# EAGLE design MotorControllerV7_ControlBoard (EAGLE 7.1.0)
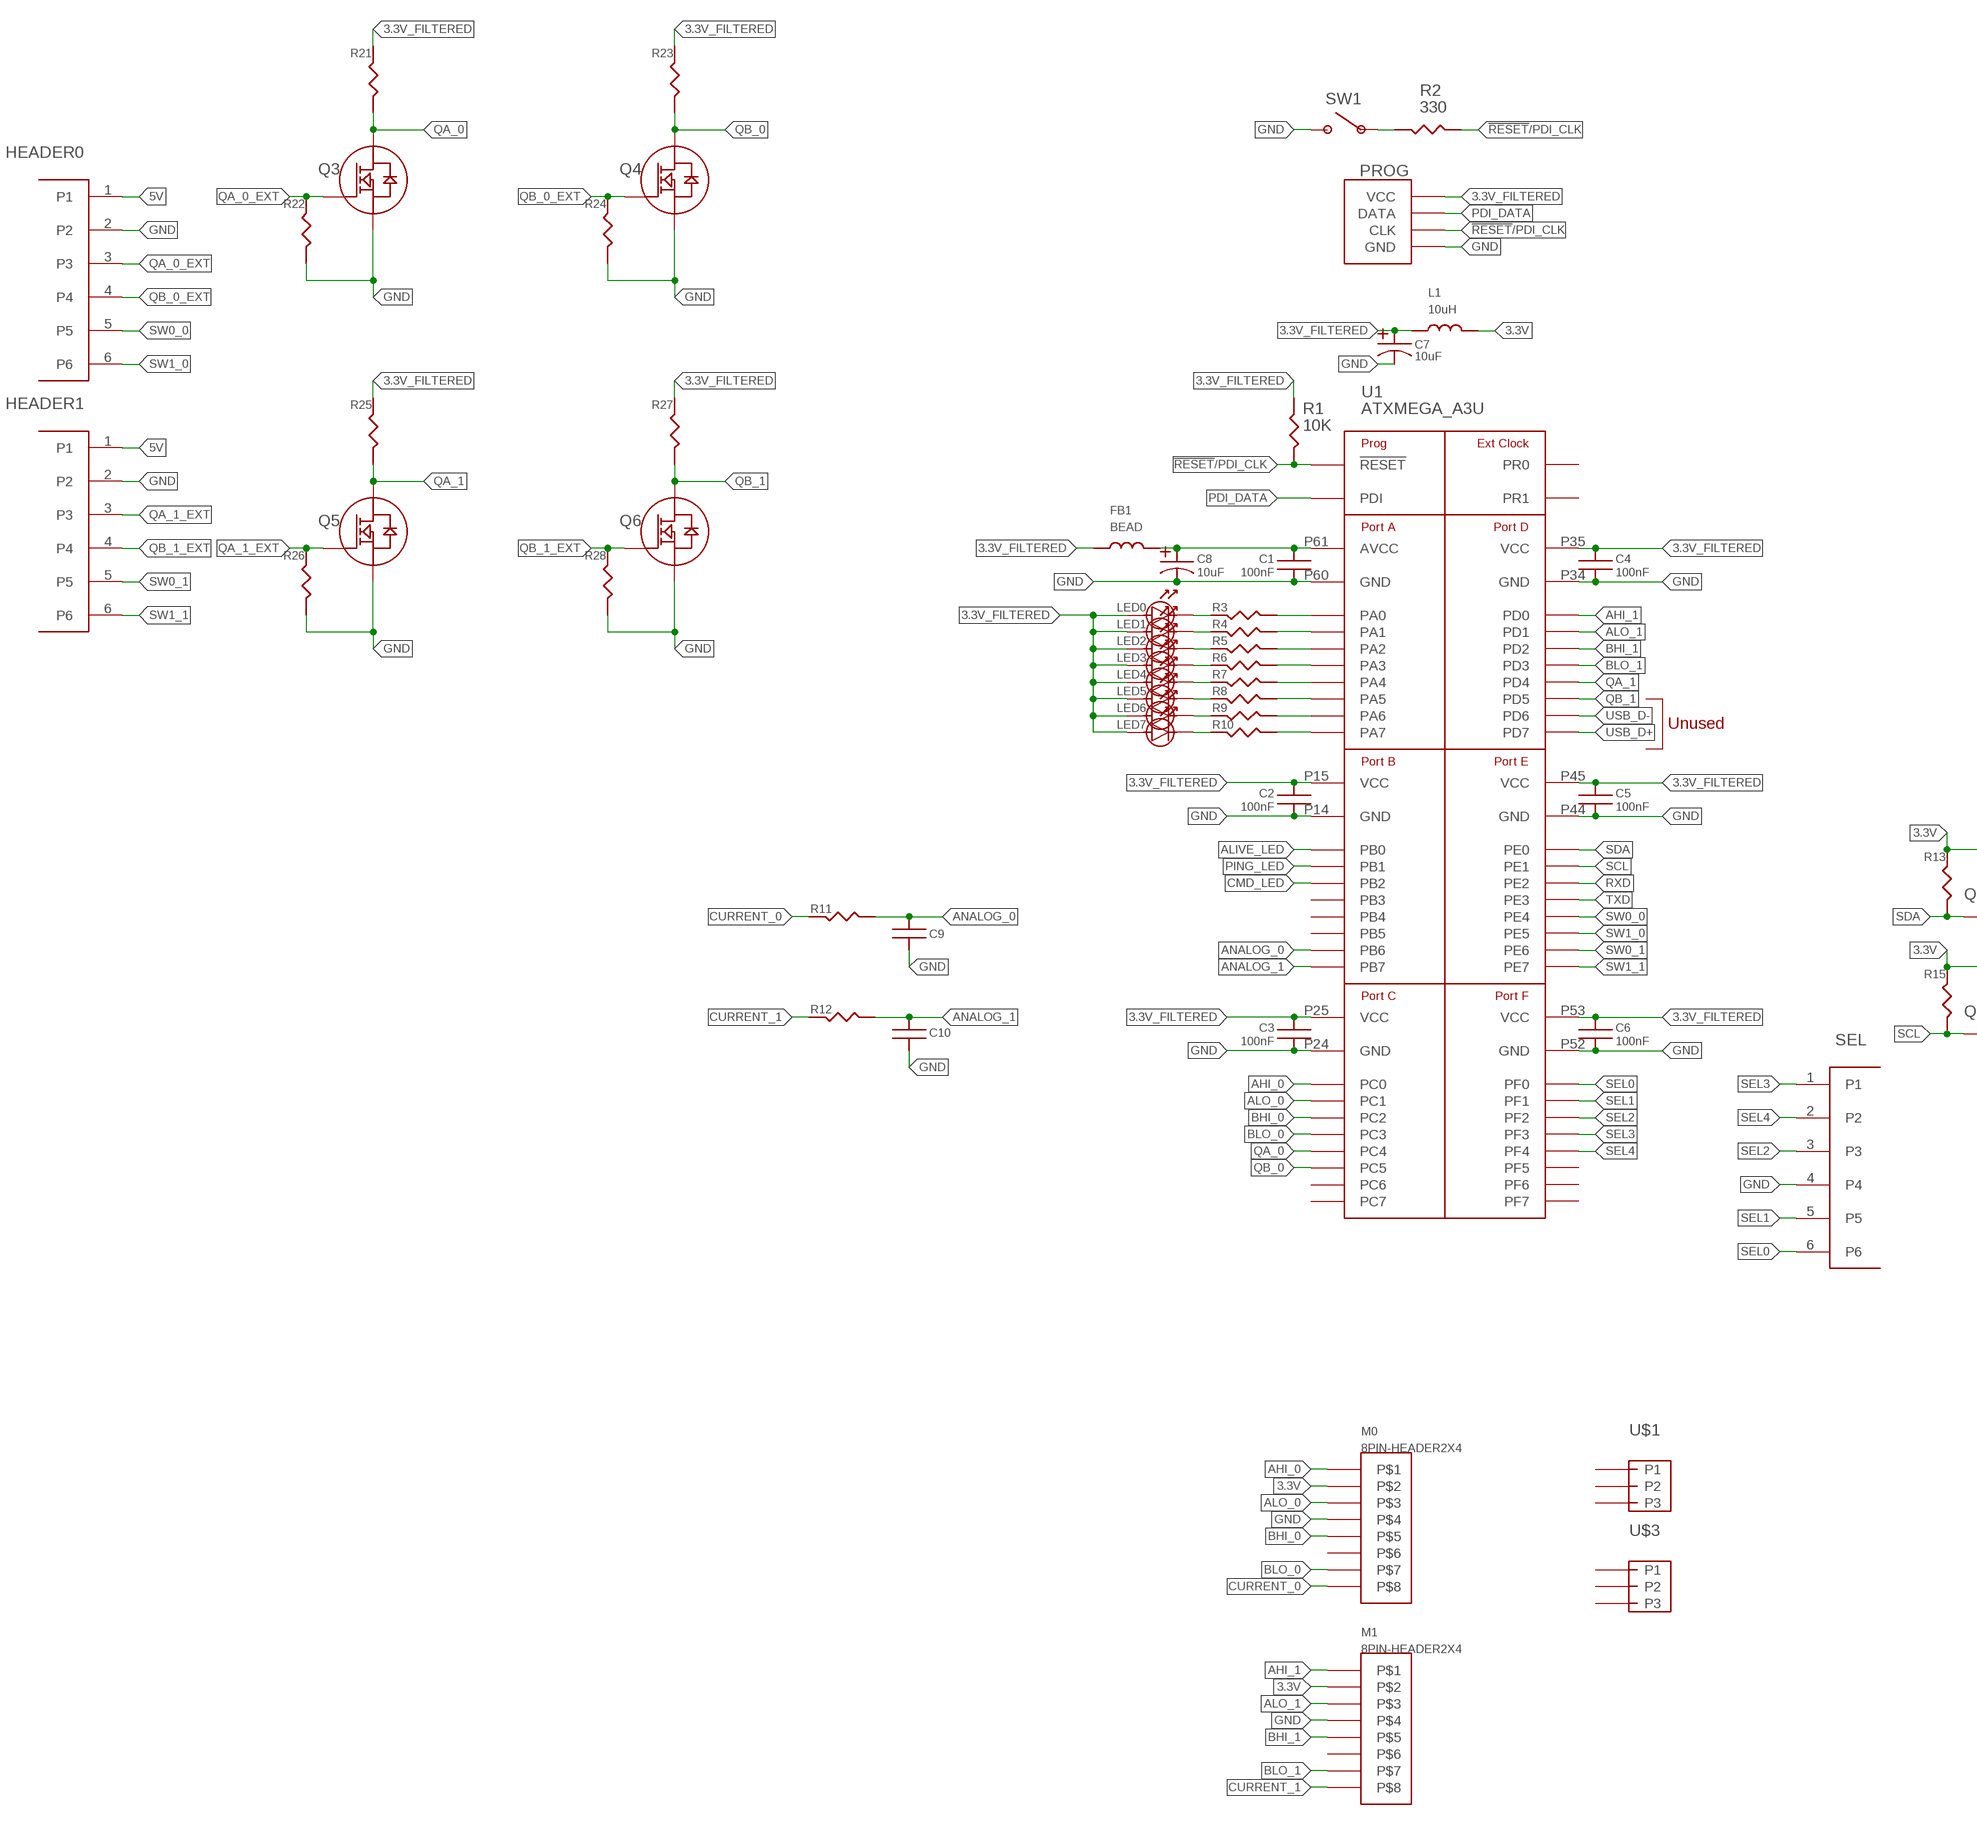
[diagram p0: schematic, sheet 1, part 1 of 2]
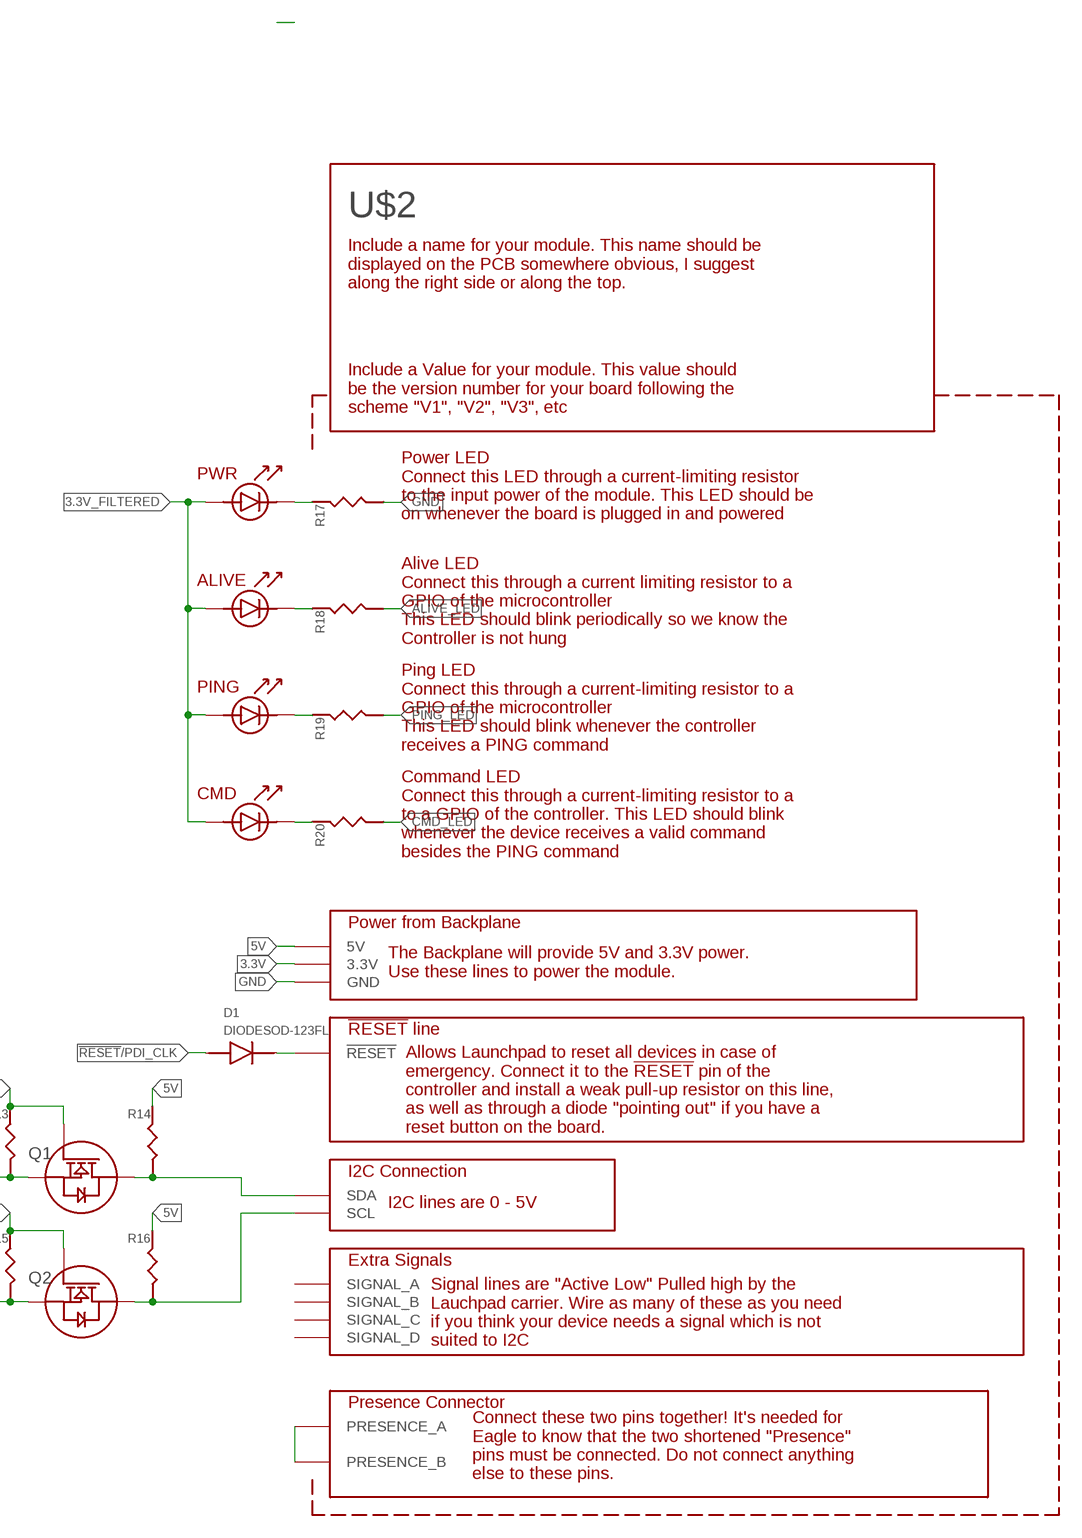
[diagram p1: schematic, sheet 1, part 2 of 2]

## Parts
C1  100nF  CAPACITOR-UNPOLARIZED0805  [0805_STACKPOLERESISTOR]
C2  100nF  CAPACITOR-UNPOLARIZED0805  [0805_STACKPOLERESISTOR]
C3  100nF  CAPACITOR-UNPOLARIZED0805  [0805_STACKPOLERESISTOR]
C4  100nF  CAPACITOR-UNPOLARIZED0805  [0805_STACKPOLERESISTOR]
C5  100nF  CAPACITOR-UNPOLARIZED0805  [0805_STACKPOLERESISTOR]
C6  100nF  CAPACITOR-UNPOLARIZED0805  [0805_STACKPOLERESISTOR]
C7  10uF  CAPACITORCAP_2MM  [CAP_2MM]
C8  10uF  CAPACITORCAP_2MM  [CAP_2MM]
C9  CAPACITOR-UNPOLARIZED0805  [0805_STACKPOLERESISTOR]
C10  CAPACITOR-UNPOLARIZED0805  [0805_STACKPOLERESISTOR]
D1  DIODESOD-123FL  [SOD-123FL]
FB1  BEAD  INDUCTOR  [0805_STACKPOLERESISTOR]
HEADER0  6PIN-HEADERMOLEX  [6PIN_MOLEX]
HEADER1  6PIN-HEADERMOLEX  [6PIN_MOLEX]
L1  10uH  INDUCTOR  [0805_STACKPOLERESISTOR]
LED0  LED  [0805_LED]
LED1  LED  [0805_LED]
LED2  LED  [0805_LED]
LED3  LED  [0805_LED]
LED4  LED  [0805_LED]
LED5  LED  [0805_LED]
LED6  LED  [0805_LED]
LED7  LED  [0805_LED]
M0  8PIN-HEADER2X4  [8PIN_2X4]
M1  8PIN-HEADER2X4  [8PIN_2X4]
PROG  PDI_HEADER  [6PINHEADER_CORRECT]
Q1  NMOSSOT-23  [SOT-23]
Q2  NMOSSOT-23  [SOT-23]
Q3  NMOSSOT-23  [SOT-23]
Q4  NMOSSOT-23  [SOT-23]
Q5  NMOSSOT-23  [SOT-23]
Q6  NMOSSOT-23  [SOT-23]
R1  10K  RESISTOR  [0805_STACKPOLERESISTOR]
R2  330  RESISTOR  [0805_STACKPOLERESISTOR]
R3  RESISTOR  [0805_STACKPOLERESISTOR]
R4  RESISTOR  [0805_STACKPOLERESISTOR]
R5  RESISTOR  [0805_STACKPOLERESISTOR]
R6  RESISTOR  [0805_STACKPOLERESISTOR]
R7  RESISTOR  [0805_STACKPOLERESISTOR]
R8  RESISTOR  [0805_STACKPOLERESISTOR]
R9  RESISTOR  [0805_STACKPOLERESISTOR]
R10  RESISTOR  [0805_STACKPOLERESISTOR]
R11  RESISTOR  [0805_STACKPOLERESISTOR]
R12  RESISTOR  [0805_STACKPOLERESISTOR]
R13  RESISTOR  [0805_STACKPOLERESISTOR]
R14  RESISTOR  [0805_STACKPOLERESISTOR]
R15  RESISTOR  [0805_STACKPOLERESISTOR]
R16  RESISTOR  [0805_STACKPOLERESISTOR]
R17  RESISTOR  [0805_STACKPOLERESISTOR]
R18  RESISTOR  [0805_STACKPOLERESISTOR]
R19  RESISTOR  [0805_STACKPOLERESISTOR]
R20  RESISTOR  [0805_STACKPOLERESISTOR]
R21  RESISTOR  [0805_STACKPOLERESISTOR]
R22  RESISTOR  [0805_STACKPOLERESISTOR]
R23  RESISTOR  [0805_STACKPOLERESISTOR]
R24  RESISTOR  [0805_STACKPOLERESISTOR]
R25  RESISTOR  [0805_STACKPOLERESISTOR]
R26  RESISTOR  [0805_STACKPOLERESISTOR]
R27  RESISTOR  [0805_STACKPOLERESISTOR]
R28  RESISTOR  [0805_STACKPOLERESISTOR]
SEL  6PIN-HEADER2X3  [6PINHEADER_CORRECT]
SW1  PUSHBUTTON  [PUSHBUTTON(THROUGH-HOLE)]
U1  ATXMEGA_A3U  [64-TQFP-0.8GRID]
U$1  3PIN_HEADER  [3PIN_HEADER]
U$2  EMBEDDED_SUBSYSTEM_V2MEDIUM  [SUBSYSTEM2016_V2-MEDIUM]
U$3  3PIN_HEADER  [3PIN_HEADER]

## Nets
3.3V: L1.P$2 M0.2 M1.2 Q1.G(GATE) Q2.G(GATE) R13.P$2 R15.P$2 U$2.A3(3.3V) U$2.A4(3.3V)
3.3V_FILTERED: C2.P$1 C3.P$1 C4.P$1 C5.P$1 C6.P$1 C7.PLUS(POSITIVE_LEAD) FB1.P$1 L1.P$1 LED0.ANODE LED1.ANODE LED2.ANODE LED3.ANODE LED4.ANODE LED5.ANODE LED6.ANODE LED7.ANODE PROG.2(VCC) R1.P$1 R21.P$2 R23.P$2 R25.P$2 R27.P$2 U1.P15(VCC) U1.P25(VCC) U1.P35(VCC) U1.P45(VCC) U1.P53(VCC) U$2.ALIVELED_ANODE U$2.CMDLED_ANODE U$2.PINGLED_ANODE U$2.PWRLED_ANODE
5V: HEADER0.1 HEADER1.1 R14.P$2 R16.P$2 U$2.B2(5V) U$2.B3(5V)
!RESET!/PDI_CLK: D1.ANODE PROG.5(CLK) R1.P$2 R2.P$2 U1.P57(!RESET!)
AHI_0: M0.1 U1.P16(PC0)
AHI_1: M1.1 U1.P26(PD0)
ALIVE_LED: R18.P$1 U1.P6(PB0)
ALO_0: M0.3 U1.P17(PC1)
ALO_1: M1.3 U1.P27(PD1)
ANALOG_0: C9.P$1 R11.P$2 U1.P12(PB6)
ANALOG_1: C10.P$1 R12.P$2 U1.P13(PB7)
BHI_0: M0.5 U1.P18(PC2)
BHI_1: M1.5 U1.P28(PD2)
BLO_0: M0.7 U1.P19(PC3)
BLO_1: M1.7 U1.P29(PD3)
CMD_LED: R20.P$1 U1.P8(PB2)
CURRENT_0: M0.8 R11.P$1
CURRENT_1: M1.8 R12.P$1
GND: C1.P$2 C2.P$2 C3.P$2 C4.P$2 C5.P$2 C6.P$2 C7.MINUS(NEGATIVE_LEAD) C8.MINUS(NEGATIVE_LEAD) C9.P$2 C10.P$2 HEADER0.2 HEADER1.2 M0.4 M1.4 PROG.6(GND) Q3.S(SOURCE) Q4.S(SOURCE) Q5.S(SOURCE) Q6.S(SOURCE) R17.P$1 R22.P$1 R24.P$1 R26.P$1 R28.P$1 SEL.4 SW1.3 U1.P14(GND) U1.P24(GND) U1.P34(GND) U1.P44(GND) U1.P52(GND) U1.P60(GND) U$2.A7(GND) U$2.A8(GND) U$2.A9(GND) U$2.A10(GND)
N$1: R3.P$2 U1.P62(PA0)
N$2: C1.P$1 C8.PLUS(POSITIVE_LEAD) FB1.P$2 U1.P61(AVCC)
N$3: R2.P$1 SW1.1
N$4: R4.P$2 U1.P63(PA1)
N$5: R5.P$2 U1.P64(PA2)
N$6: R6.P$2 U1.P1(PA3)
N$7: R7.P$2 U1.P2(PA4)
N$8: R8.P$2 U1.P3(PA5)
N$9: R9.P$2 U1.P4(PA6)
N$10: R10.P$2 U1.P5(PA7)
N$11: LED0.CATHODE R3.P$1
N$12: LED1.CATHODE R4.P$1
N$13: LED2.CATHODE R5.P$1
N$14: LED3.CATHODE R6.P$1
N$15: LED4.CATHODE R7.P$1
N$16: LED5.CATHODE R8.P$1
N$17: LED6.CATHODE R9.P$1
N$18: LED7.CATHODE R10.P$1
N$19: R17.P$2 U$2.PWRLED_CATHODE
N$20: U$2.A2(PRESENCE_A) U$2.B17(PRESENCE_B)
N$21: D1.CATHODE U$2.B5(!RESET) U$2.B6(!RESET)
N$22: Q2.D(DRAIN) R16.P$1 U$2.B9(SCL) U$2.B10(SCL)
N$23: Q1.D(DRAIN) R14.P$1 U$2.B7(SDA) U$2.B8(SDA)
N$25: R20.P$2 U$2.CMDLED_CATHODE
N$30: R19.P$2 U$2.PINGLED_CATHODE
N$31: R18.P$2 U$2.ALIVELED_CATHODE
PDI_DATA: PROG.1(DATA) U1.P56(PDI)
PING_LED: R19.P$1 U1.P7(PB1)
QA_0: Q3.D(DRAIN) R21.P$1 U1.P20(PC4)
QA_0_EXT: HEADER0.3 Q3.G(GATE) R22.P$2
QA_1: Q5.D(DRAIN) R25.P$1 U1.P30(PD4)
QA_1_EXT: HEADER1.3 Q5.G(GATE) R26.P$2
QB_0: Q4.D(DRAIN) R23.P$1 U1.P21(PC5)
QB_0_EXT: HEADER0.4 Q4.G(GATE) R24.P$2
QB_1: Q6.D(DRAIN) R27.P$1 U1.P31(PD5)
QB_1_EXT: HEADER1.4 Q6.G(GATE) R28.P$2
RXD: U1.P38(PE2)
SCL: Q2.S(SOURCE) R15.P$1 U1.P37(PE1)
SDA: Q1.S(SOURCE) R13.P$1 U1.P36(PE0)
SEL0: SEL.6 U1.P46(PF0)
SEL1: SEL.5 U1.P47(PF1)
SEL2: SEL.3 U1.P48(PF2)
SEL3: SEL.1 U1.P49(PF3)
SEL4: SEL.2 U1.P50(PF4)
SW0_0: HEADER0.5 U1.P40(PE4)
SW0_1: HEADER1.5 U1.P42(PE6)
SW1_0: HEADER0.6 U1.P41(PE5)
SW1_1: HEADER1.6 U1.P43(PE7)
TXD: U1.P39(PE3)
USB_D+: U1.P33(PD7)
USB_D-: U1.P32(PD6)
Unconnected: M0.6 M1.6 U1.P9(PB3) U1.P10(PB4) U1.P11(PB5) U1.P22(PC6) U1.P23(PC7) U1.P51(PF5) U1.P54(PF6) U1.P55(PF7) U1.P58(PR0) U1.P59(PR1) U$1.P1 U$1.P2 U$1.P3 U$2.A13(SIGNAL_C) U$2.A14(SIGNAL_C) U$2.A15(SIGNAL_D) U$2.A16(SIGNAL_D) U$2.B13(SIGNAL_A) U$2.B14(SIGNAL_A) U$2.B15(SIGNAL_B) U$2.B16(SIGNAL_B) U$3.P1 U$3.P2 U$3.P3

## Notes on the sheet
- Unused

## Library data of the parts
C1-C6 C9 C10 = 000_CustomPartsMaster:CAPACITOR-UNPOLARIZED
C7 C8 = 000_CustomPartsMaster:CAPACITOR
D1 = 000_CustomPartsMaster:DIODE
FB1 L1 = 000_CustomPartsMaster:INDUCTOR
HEADER0 HEADER1 SEL = 000_CustomPartsMaster:6PIN-HEADER
LED0 LED1-LED7 = 000_CustomPartsMaster:LED
M0 M1 = 000_CustomPartsMaster:8PIN-HEADER
PROG = 000_CustomPartsMaster:PDI_HEADER
Q1-Q6 = 000_CustomPartsMaster:NMOS
R1-R28 = 000_CustomPartsMaster:RESISTOR
SW1 = 000_CustomPartsMaster:PUSHBUTTON
U1 = 000_CustomPartsMaster:ATXMEGA_A3U
U$1 U$3 = 000_CustomPartsMaster:3PIN_HEADER
U$2 = 000_CustomPartsMaster:EMBEDDED_SUBSYSTEM_V2

## Board
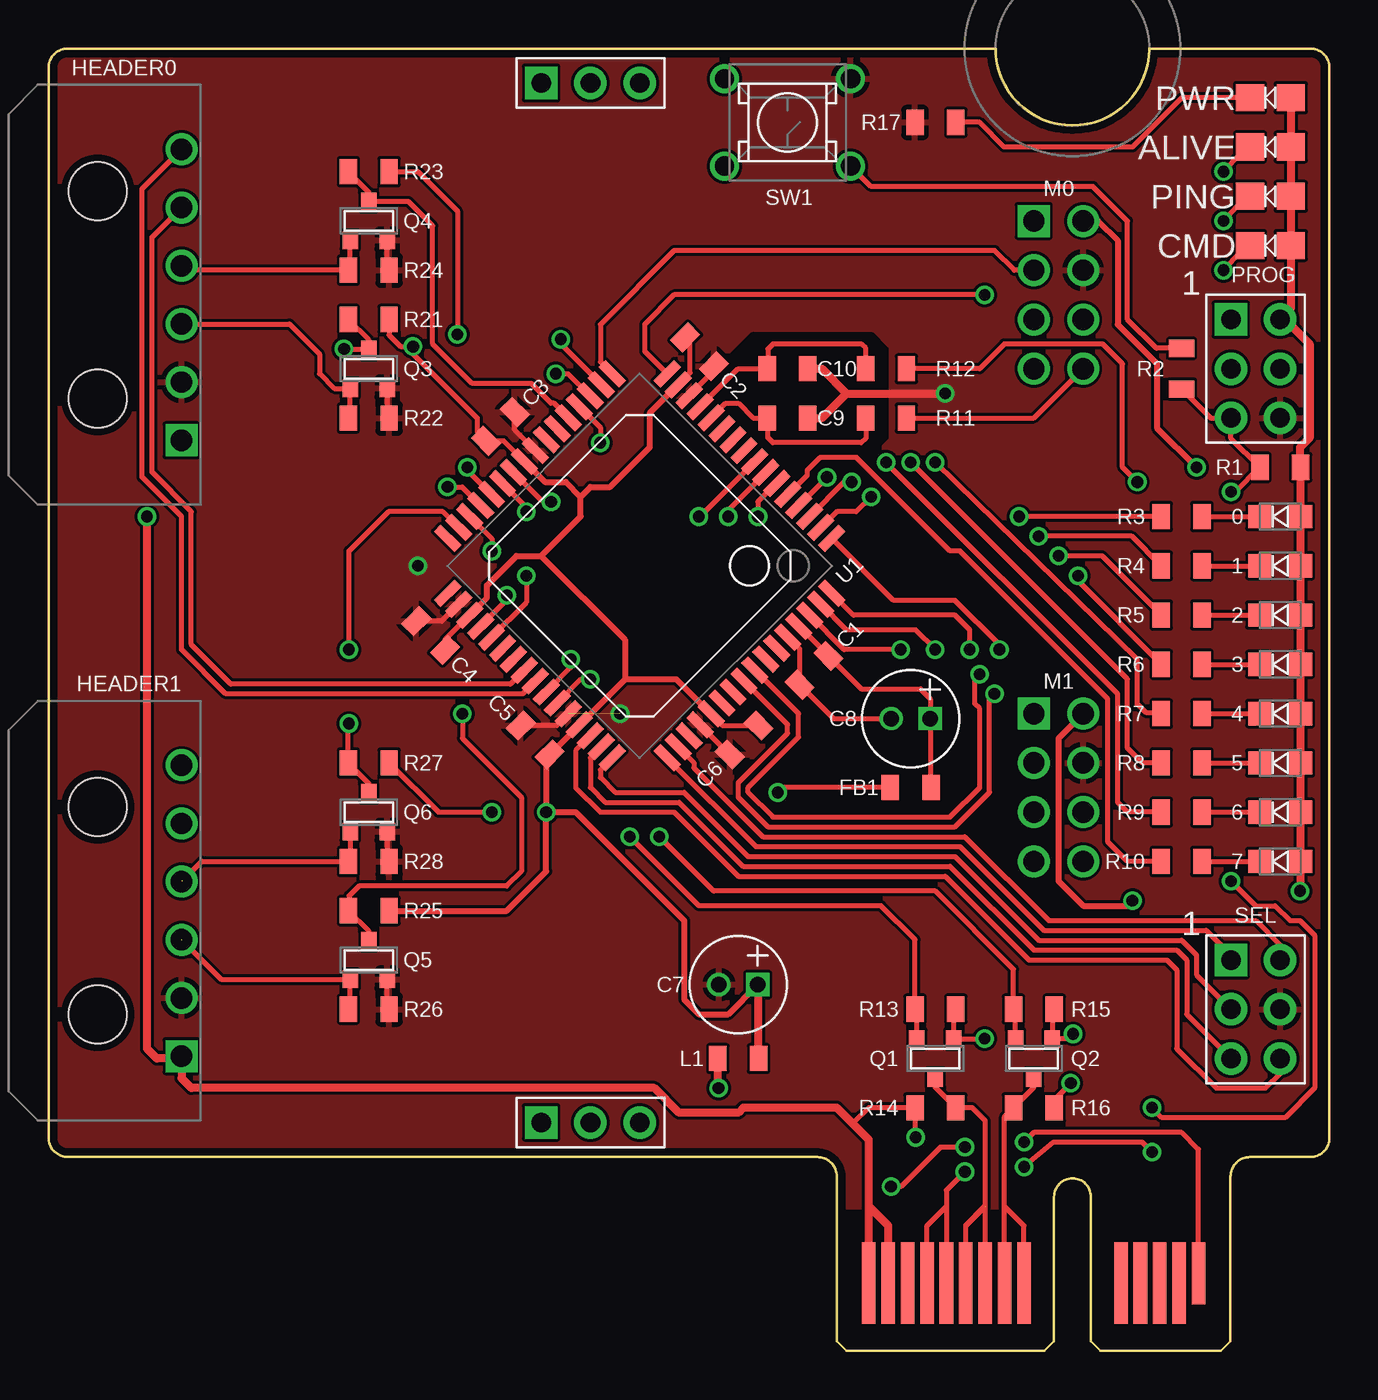
[diagram p2: board, top side]
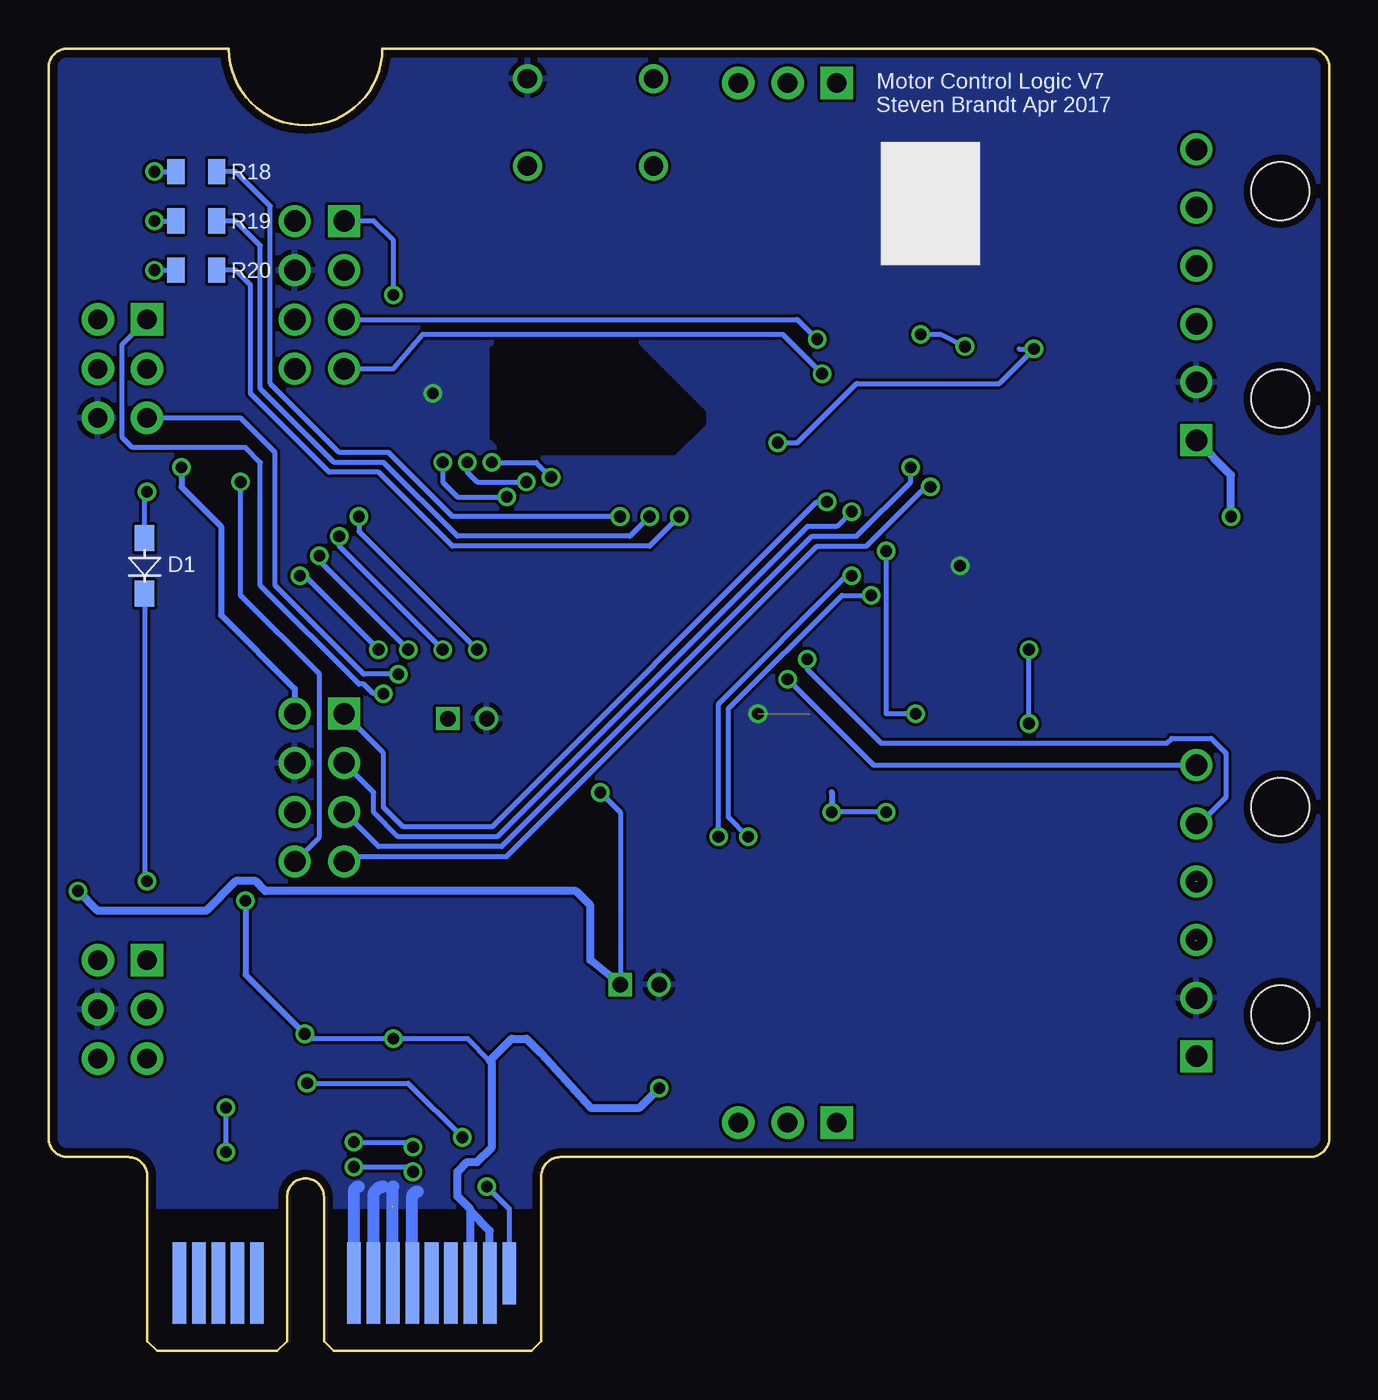
[diagram p3: board, bottom side, seen from below]

Size 66.04 x 67.15 mm. Coordinates in mm from the lower left corner, seen from the top.
Copper layers (1*16): Top 0.0356mm / dielectric 1.5011mm / Bottom 0.0356mm
Design rules "oshpark-2layer": minimum track width 6mil, minimum drill 13mil, track to track 6mil, track to pad 6mil, pad to pad 6mil, via to via 6mil, smd to smd 6mil, copper to edge 15mil, drill to drill 6mil, minimum pad ring 7mil, minimum via ring 7mil, stop-mask expansion 4mil, vias tented up to drill 0mil, thermal gap 10mil
tRestrict: area 36.3,28 to 46.7,39; area 32.3,46.3 to 43.2,52.4
bRestrict: area 32.3,46.3 to 43.2,52.4

### Footprints (pad centres in the part's own frame; a part is rotated, then mirrored left to right if it is on the bottom)
0805_STACKPOLERESISTOR = smd 0.9 x 1.3: P$1 -1.05,0; P$2 1.05,0
CAP_2MM = drill 0.8: MINUS 1,0 | drill 0.8 square: PLUS -1,0
SOD-123FL = smd 1.34 x 1: ANODE 1.43,0; CATHODE -1.43,0
6PIN_MOLEX = drill 1.1 square: 1 7.5,4.32 | drill 1.1: 2 4.5,4.32; 3 1.5,4.32; 4 -1.5,4.32; 5 -4.5,4.32; 6 -7.5,4.32 | hole 3: -5.35,0; 5.35,0
0805_LED = smd 1.2 x 1.2: ANODE -1.05,0; CATHODE 1.05,0
8PIN_2X4 = drill 1.1 square: 1 0,0 | drill 1.1: 2 2.54,0; 3 0,-2.54; 4 2.54,-2.54; 5 0,-5.08; 6 2.54,-5.08; 7 0,-7.62; 8 2.54,-7.62
6PINHEADER_CORRECT = drill 1 pad 1.676 square: 1 0,0 | drill 1 pad 1.676: 2 2.54,0; 3 0,-2.54; 4 2.54,-2.54; 5 0,-5.08; 6 2.54,-5.08
SOT-23 = smd 0.8 x 0.9: D 0,1; G -0.95,-1; S 0.95,-1
PUSHBUTTON(THROUGH-HOLE) = drill 1: 1 -3.25,2.25; 2 3.25,2.25; 3 -3.25,-2.25; 4 3.25,-2.25
64-TQFP-0.8GRID = smd 1.5 x 0.5: P1 -8,6; P2 -8,5.2; P3 -8,4.4; P4 -8,3.6; P5 -8,2.8; P6 -8,2; P7 -8,1.2; P8 -8,0.4; P9 -8,-0.4; P10 -8,-1.2; P11 -8,-2; P12 -8,-2.8; P13 -8,-3.6; P14 -8,-4.4; P15 -8,-5.2; P16 -8,-6; P33 8,-6; P34 8,-5.2; P35 8,-4.4; P36 8,-3.6; P37 8,-2.8; P38 8,-2; P39 8,-1.2; P40 8,-0.4; P41 8,0.4; P42 8,1.2; P43 8,2; P44 8,2.8; P45 8,3.6; P46 8,4.4; P47 8,5.2; P48 8,6 | smd 0.5 x 1.5: P17 -6,-8; P18 -5.2,-8; P19 -4.4,-8; P20 -3.6,-8; P21 -2.8,-8; P22 -2,-8; P23 -1.2,-8; P24 -0.4,-8; P25 0.4,-8; P26 1.2,-8; P27 2,-8; P28 2.8,-8; P29 3.6,-8; P30 4.4,-8; P31 5.2,-8; P32 6,-8; P49 6,8; P50 5.2,8; P51 4.4,8; P52 3.6,8; P53 2.8,8; P54 2,8; P55 1.2,8; P56 0.4,8; P57 -0.4,8; P58 -1.2,8; P59 -2,8; P60 -2.8,8; P61 -3.6,8; P62 -4.4,8; P63 -5.2,8; P64 -6,8
3PIN_HEADER = drill 1.016 pad 1.676 square: P1 0,2.54 | drill 1.016 pad 1.676: P2 0,0; P3 0,-2.54
SUBSYSTEM2016_V2-MEDIUM = smd 0.7 x 3.2 bottom: A2 42.29,4.16 | smd 0.7 x 4.2 bottom: A3 43.29,3.66; A4 44.29,3.66; A5 45.29,3.66; A6 46.29,3.66; A7 47.29,3.66; A8 48.29,3.66; A9 49.29,3.66; A10 50.29,3.66; A13 55.29,3.66; A14 56.29,3.66; A15 57.29,3.66; A16 58.29,3.66; A17 59.29,3.66 | smd 1.45 x 1.4: ALIVELED_ANODE 64.042,62.23; ALIVELED_CATHODE 61.942,62.23; CMDLED_ANODE 64.042,57.15; CMDLED_CATHODE 61.942,57.15; PINGLED_ANODE 64.042,59.69; PINGLED_CATHODE 61.942,59.69; PWRLED_ANODE 64.042,64.77; PWRLED_CATHODE 61.942,64.77 | smd 0.7 x 4.2: B2 42.29,3.66; B3 43.29,3.66; B4 44.29,3.66; B5 45.29,3.66; B6 46.29,3.66; B7 47.29,3.66; B8 48.29,3.66; B9 49.29,3.66; B10 50.29,3.66; B13 55.29,3.66; B14 56.29,3.66; B15 57.29,3.66; B16 58.29,3.66 | smd 0.7 x 3.2: B17 59.29,4.16

### Placement (x,y rotation side)
C1  39.46,35.09 225 top
C2  33.56,51.51 315 top
C3  23.3,47.66 45 top
C4  19.7,36.89 135 top
C5  25.09,31.5 135 top
C6  35.87,31.5 225 top
C7  35.56,18.89 180 top
C8  44.45,32.61 180 top
C9  38.1,48.1 0 top
C10  38.1,50.64 0 top
D1  61.09,40.48 90 bottom
FB1  44.45,29.05 0 top
HEADER0  2.54,54.45 270 top
HEADER1  2.54,22.7 270 top
L1  35.56,15.08 180 top
LED0  63.5,43.02 180 top
LED1  63.5,40.48 180 top
LED2  63.5,37.94 180 top
LED3  63.5,35.4 180 top
LED4  63.5,32.86 180 top
LED5  63.5,30.32 180 top
LED6  63.5,27.78 180 top
LED7  63.5,25.24 180 top
M0  50.8,58.26 0 top
M1  50.8,32.86 0 top
PROG  60.96,53.18 0 top
Q1  45.72,15.08 180 top
Q2  50.8,15.08 180 top
Q3  16.51,50.64 0 top
Q4  16.51,58.26 0 top
Q5  16.51,20.16 0 top
Q6  16.51,27.78 0 top
R1  63.5,45.56 180 top
R2  58.42,50.64 270 top
R3  58.42,43.02 180 top
R4  58.42,40.48 180 top
R5  58.42,37.94 180 top
R6  58.42,35.4 180 top
R7  58.42,32.86 180 top
R8  58.42,30.32 180 top
R9  58.42,27.78 180 top
R10  58.42,25.24 180 top
R11  43.18,48.1 180 top
R12  43.18,50.64 180 top
R13  45.72,17.62 0 top
R14  45.72,12.54 180 top
R15  50.8,17.62 0 top
R16  50.8,12.54 0 top
R17  45.72,63.34 0 top
R18  58.42,60.8 180 bottom
R19  58.42,58.26 180 bottom
R20  58.42,55.72 180 bottom
R21  16.51,53.18 0 top
R22  16.51,48.1 180 top
R23  16.51,60.8 0 top
R24  16.51,55.72 180 top
R25  16.51,22.7 0 top
R26  16.51,17.62 180 top
R27  16.51,30.32 0 top
R28  16.51,25.24 180 top
SEL  60.96,20.16 0 top
SW1  38.1,63.34 180 top
U1  30.48,40.48 225 top
U$1  27.94,11.78 90 top
U$2  0,-0.16 0 top
U$3  27.94,65.37 90 top

### Tracks (layer width: path | path; a pad name or v marks a point on that pad's centre or on a via)
3.3V  (via drill 0.6)
  Top 0.254: R15.P$2 51.75,17.62 Q2.G 52.56,16.08 v52.83,16.35 | R13.P$2 46.67,17.52 Q1.G 48.24,16.08 v48.26,16.1 | v34.54,13.56 34.51,13.59
  Top 0.305: M0.2 54.1,58.26 55.12,57.24 55.12,52.93 57.15,50.89 57.15,47.59 v59.18,45.56 | M1.2 52.07,31.59 52.07,24.22 53.34,22.95 55.63,22.95 v55.88,23.21
  Top 0.406: 34.51,13.59 L1.P$2
  Bottom 0.254: v52.83,16.35 52.58,16.1 v48.26,16.1 44.42,16.1 43.29,14.97
  Bottom 0.305: v59.18,45.56 59.18,44.54 57.15,42.51 57.15,37.94 53.34,34.13 M1.2 | v55.88,23.21 55.88,19.4 v52.83,16.35
  Bottom 0.406: U$2.A4 44.29,7.21 | 44.29,7.21 44.29,7.3 44.96,7.97 44.96,9.24 44.45,9.75 43.94,9.75 43.18,10.51 43.18,14.86 43.29,14.97 42.16,16.1 41.4,16.1 40.64,15.33 38.1,12.54 35.56,12.54 v34.54,13.56 | U$2.A3 43.29,6.21 44.29,7.21
3.3V_FILTERED  (via drill 0.6)
  Top 0.254: U1.P15 33.08,50.43 33.08,52.16 33.02,52.16 C2.P$1 | U1.P25 23.47,46.92 C3.P$1 22.1,47.38 22.1,48.1 18.8,51.4 v18.8,51.78 18.16,51.78 17.56,52.38 R21.P$2 | U1.P35 20.45,36.67 C4.P$1 | 25.85,30.76 C5.P$1 | C6.P$1 34.76,32.24 U1.P53 | R23.P$2 19.05,60.8 21.08,58.77 v21.08,52.42 | U1.P53 | FB1.P$1 37.85,29.05 v37.59,28.8 | R27.P$2 20.1,27.78 v22.86,27.78
  Top 0.305: R25.P$2 23.62,22.7 25.65,24.73 v25.65,27.78 | v25.65,27.78 27.18,27.78 32.77,22.19 32.77,18.13 33.53,17.37 35.05,17.37 36.56,18.87 C7.PLUS | v25.65,27.78 25.65,30.58 C5.P$1 25.85,30.76 U1.P45 29.72,34.63 | U1.P35 22.61,38.83 22.61,39.46 24.13,40.99 25.4,40.99 | U1.P25 25.6,44.8 26.67,44.8 27.43,44.04 | U1.P15 30.99,48.34 30.99,46.58 28.96,44.54 27.94,44.54 27.43,44.04 | U1.P53 32.37,34.63 29.72,34.63 | 25.4,40.99 29.72,36.67 29.72,34.63 | 25.4,40.99 27.43,43.02 27.43,44.04
  Top 0.406: U$2.PWRLED_ANODE U$2.ALIVELED_ANODE U$2.PINGLED_ANODE U$2.CMDLED_ANODE 64.04,53.72 PROG.2 63.75,53.18 65.02,51.91 65.02,47.08 64.52,46.58 64.52,45.59 R1.P$1 LED0.ANODE LED1.ANODE LED2.ANODE LED3.ANODE LED4.ANODE LED5.ANODE LED6.ANODE LED7.ANODE 64.55,23.75 v64.52,23.72 | L1.P$1 36.61,18.84 C7.PLUS
  Bottom 0.254: v37.59,28.8 36.56,27.76 C7.PLUS | v21.08,52.42 20.07,52.42 v18.8,51.78 | v22.86,27.78 v25.65,27.78
  Bottom 0.305: 25.65,28.8 v25.65,27.78
  Bottom 0.406: C7.PLUS 38.1,20.16 38.1,22.97 38.85,23.72 54.86,23.72 55.37,24.22 56.39,24.22 57.91,22.7 63.5,22.7 v64.52,23.72
5V  (via drill 0.6)
  Top 0.254: R16.P$2 51.85,12.96 v52.7,13.81 | v44.7,11.02 44.7,12.51 R14.P$2 42.29,12.54 41.53,11.78 41.53,11.65
  Top 0.406: 42.29,7.46 43.29,6.46 U$2.B3 | U$2.B2 42.29,7.46 | 42.29,7.46 42.29,10.89 41.53,11.65 40.64,12.54 35.81,12.54 35.56,12.29 32.51,12.29 31.24,13.56 7.37,13.56 6.86,14.06 HEADER1.1 | HEADER1.1 | HEADER1.1 6.74,15.08 5.59,15.08 5.08,15.59 v5.08,43.02
  Bottom 0.254: v52.7,13.81 47.5,13.81 v44.7,11.02
  Bottom 0.406: v5.08,43.02 5.08,45.17 HEADER0.1
!RESET!/PDI_CLK  (via drill 0.6)
  Top 0.254: U1.P57 38.67,32.86 38.67,31.65 36.07,29.05 36.07,28.8 37.34,27.53 46.48,27.53 48.01,29.05 48.01,33.11 47.75,33.37 47.75,34.64 v48.01,34.89 | R2.P$2 59.91,48.1 PROG.5 60.96,47.05 R1.P$2 61.18,44.29 v60.96,44.29
  Bottom 0.254: v48.01,34.89 49.78,34.89 54.36,39.46 54.36,46.32 56.13,48.1 PROG.5 | D1.ANODE 61.09,44.16 v60.96,44.29
AHI_0  (via drill 0.6)
  Top 0.254: v48.26,54.45 32.26,54.45 30.73,52.93 30.73,51.54 U1.P16
  Bottom 0.254: v48.26,54.45 48.26,57.24 49.28,58.26 M0.1
AHI_1  (via drill 0.6)
  Top 0.254: v25.91,43.78 25.4,43.86 U1.P26
  Bottom 0.254: M1.1 48.77,30.83 48.77,28.03 47.75,27.02 43.18,27.02 26.42,43.78 v25.91,43.78
ALIVE_LED  (via drill 0.6)
  Top 0.254: U1.P6 37.52,44.72 36.58,43.78 v36.58,43.02
  Bottom 0.254: v36.58,43.02 45.21,43.02 48.51,46.32 51.05,46.32 54.61,49.88 54.61,59.02 56.39,60.8 R18.P$1
ALO_0
  Top 0.254: U1.P17 28.45,51 28.45,52.93 32.26,56.74 48.77,56.74 49.78,55.72 M0.3
ALO_1  (via drill 0.6)
  Top 0.254: v24.64,43.27 24.64,43.49 U1.P27
  Bottom 0.254: v24.64,43.27 25.4,42.51 26.92,42.51 42.93,26.51 48.01,26.51 49.28,27.78 49.28,28.8 M1.3
ANALOG_0
  Top 0.254: U1.P12 34.9,48.86 35.56,48.86 36.32,48.1 C9.P$1 37.08,48.07 37.08,47.08 37.34,46.83 41.91,46.83 42.13,47.05 R11.P$2
ANALOG_1
  Top 0.254: U1.P13 35.55,50.64 C10.P$1 37.08,50.67 37.08,51.66 37.34,51.91 41.91,51.91 42.13,51.69 R12.P$2
BHI_0  (via drill 0.6)
  Top 0.254: v26.42,52.16 26.42,51.9 U1.P18
  Bottom 0.254: M0.5 27.43,53.18 v26.42,52.16
BHI_1  (via drill 0.6)
  Top 0.254: v21.59,45.56 21.69,45.31 U1.P28
  Bottom 0.254: v21.59,45.56 21.59,44.8 24.38,42 26.67,42 42.67,26 49.02,26 M1.5
BLO_0  (via drill 0.6)
  Top 0.254: v26.16,50.39 26.8,50.39 U1.P19
  Bottom 0.254: M0.7 48.26,50.64 46.74,52.42 28.19,52.42 v26.16,50.39
BLO_1  (via drill 0.6)
  Top 0.254: v20.57,44.54 21.32,44.54 U1.P29
  Bottom 0.254: M1.7 50.55,25.49 42.42,25.49 26.42,41.5 23.88,41.5 20.83,44.54 v20.57,44.54
CMD_LED  (via drill 0.6)
  Top 0.254: U1.P8 33.78,43.22 v33.53,43.02
  Bottom 0.254: v33.53,43.02 35.05,41.5 45.21,41.5 49.02,45.31 51.56,45.31 55.63,49.37 55.63,54.96 56.39,55.72 R20.P$1
CURRENT_0
  Top 0.254: R11.P$1 50.8,48.1 M0.8
CURRENT_1  (via drill 0.6)
  Top 0.254: R12.P$1 48.01,50.64 49.28,51.91 54.36,51.91 55.37,50.89 55.37,45.56 v56.13,44.8
  Bottom 0.254: M1.8 52.07,26.51 52.07,34.89 56.13,38.96 v56.13,44.8
GND  (via drill 0.6)  (1 unrouted)
  Top 0.254: U1.P14 34.29,50.51 C2.P$2 | U1.P24 24.04,47.49 C3.P$2 | U1.P34 20.28,37.63 C4.P$2 | U1.P44 26.2,32.24 C5.P$2 | U1.P52 35.11,30.76 C6.P$2 | U1.P60 38.72,36.2 C1.P$2 40.46,32.61 C8.MINUS | Q3.S 17.46,48.1 R22.P$1 | R24.P$1 17.46,55.82 Q4.S | R26.P$1 17.46,17.72 Q5.S | Q6.S 17.46,25.34 R28.P$1
  Top 0.406: C9.P$2 39.88,48.1 41.15,49.37 | 41.15,49.37 v46.23,49.37 | C10.P$2 39.88,50.64 41.15,49.37
  Bottom 0.61: U$2.A7 47.29,7.92 arc90 46.99,8.22 | U$2.A8 48.29,8.45 arc90 48.26,8.48 | U$2.A9 49.29,7.95 arc90 48.77,8.48 | U$2.A10 50.29,8.22 arc90 50.04,8.48
  other vias: 19.05,40.48 29.46,32.86
  pour Top: -2.54,68.42 -2.54,7.46 68.58,7.46 68.58,68.42
  pour Bottom: -2.54,68.42 -2.54,7.46 68.58,7.46 68.58,68.42
N$1  (via drill 0.6)
  Top 0.254: R3.P$2 v50.04,43.02 | v43.94,36.16 41.02,36.16 U1.P62
  Bottom 0.254: v50.04,43.02 50.04,42.26 v43.94,36.16
N$2
  Top 0.254: U1.P61 40.2,35.85 C1.P$1 41.91,34.13 44.96,34.13 45.47,33.62 45.47,32.62 C8.PLUS 45.5,32.56 FB1.P$2
N$3
  Top 0.254: R2.P$1 57.12,51.69 55.63,53.18 55.63,58.26 53.85,60.04 42.4,60.04 SW1.1
N$4  (via drill 0.6)
  Top 0.254: R4.P$2 55.85,42 v51.05,42 | v45.72,36.16 44.7,37.18 41.14,37.18 U1.P63
  Bottom 0.254: v51.05,42 51.05,41.5 v45.72,36.16
N$5  (via drill 0.6)
  Top 0.254: R5.P$2 54.32,40.99 v52.07,40.99 | v47.5,36.16 47.5,37.18 46.74,37.94 41.51,37.94 U1.P64
  Bottom 0.254: v52.07,40.99 52.07,40.73 v47.5,36.16
N$6  (via drill 0.6)
  Top 0.254: R6.P$2 53.09,39.68 v53.09,39.97 | v49.02,36.16 49.02,36.42 46.74,38.7 43.57,38.7 U1.P1
  Bottom 0.254: v53.09,39.97 52.83,39.97 v49.02,36.16
N$7  (via drill 0.6)
  Top 0.254: R7.P$2 57.4,32.89 56.61,32.89 56.13,33.37 56.13,35.65 v45.72,45.81 | v42.42,44.04 41.64,43.27 40.64,43.27 U1.P2
  Bottom 0.254: v45.72,45.81 45.72,44.8 44.96,44.04 v42.42,44.04
N$8  (via drill 0.6)
  Top 0.254: R8.P$2 56.39,30.32 55.63,31.08 55.63,34.64 v44.45,45.81 | v41.4,44.8 41.02,44.8 U1.P3
  Bottom 0.254: v44.45,45.81 44.45,45.31 43.94,44.8 v41.4,44.8
N$9  (via drill 0.6)
  Top 0.254: R9.P$2 55.63,27.78 55.12,28.29 55.12,33.88 v43.18,45.81 | v40.13,45.05 v40.13,45.04 U1.P4
  Bottom 0.254: v43.18,45.81 40.89,45.81 v40.13,45.05
N$10
  Top 0.254: R10.P$2 55.63,25.24 54.61,26.26 54.61,33.62 46.99,41.24 46.48,41.24 41.66,46.07 39.77,46.07 39.12,45.41 39.12,45.16 U1.P5
N$11
  Top 0.254: R3.P$1 LED0.CATHODE
N$12
  Top 0.254: R4.P$1 LED1.CATHODE
N$13
  Top 0.254: R5.P$1 LED2.CATHODE
N$14
  Top 0.254: R6.P$1 LED3.CATHODE
N$15
  Top 0.254: R7.P$1 LED4.CATHODE
N$16
  Top 0.254: R8.P$1 LED5.CATHODE
N$17
  Top 0.254: R9.P$1 LED6.CATHODE
N$18
  Top 0.254: R10.P$1 LED7.CATHODE
N$19
  Top 0.254: U$2.PWRLED_CATHODE 58.42,64.61 55.88,62.07 49.28,62.07 48.01,63.34 R17.P$2
N$20  (via drill 0.6)
  Top 0.254: U$2.B17 59.29,10.4 58.42,11.27 50.8,11.27 v50.29,10.76 | v47.24,10.51 45.97,10.51 43.94,8.48 v43.43,8.48
  Bottom 0.254: v50.29,10.76 47.5,10.76 v47.24,10.51 | v43.43,8.48 42.29,7.33 U$2.A2
N$21  (via drill 0.6)
  Top 0.254: v60.96,24.22 62.23,22.95 63.25,22.95 64.01,22.19 64.52,22.19 65.28,21.43 65.28,13.56 63.75,12.03 57.4,12.03 v56.9,12.54 | v56.9,10.25 56.39,10.76 51.82,10.76 v50.29,9.49 | v47.24,9.24 46.29,8.28 46.29,7.46 | 46.29,7.46 U$2.B6 | U$2.B5 45.29,6.46 46.29,7.46
  Bottom 0.254: D1.CATHODE 61.09,24.35 v60.96,24.22 | v56.9,12.54 v56.9,10.25 | v50.29,9.49 47.5,9.49 v47.24,9.24
N$22
  Top 0.254: Q2.D 50.8,13.59 R16.P$1 49.29,12.08 49.29,7.46 | 49.29,7.46 50.29,6.46 U$2.B10 | U$2.B9 49.29,7.46
N$23  (1 unrouted)
  Top 0.254: Q1.D 45.72,13.59 R14.P$1 47.62,12.54 48.29,11.88 48.29,7.46 47.29,6.46 | U$2.B7 47.29,6.49 48.26,7.46 48.29,7.43 U$2.B8
N$25  (via drill 0.6)
  Top 0.254: U$2.CMDLED_CATHODE 61.72,56.99 v60.58,55.72
  Bottom 0.254: v60.58,55.72 R20.P$2
N$30  (via drill 0.6)
  Top 0.254: U$2.PINGLED_CATHODE 61.72,59.53 v60.58,58.26
  Bottom 0.254: v60.58,58.26 R19.P$2
N$31  (via drill 0.6)
  Top 0.254: U$2.ALIVELED_CATHODE 61.72,62.07 v60.58,60.8
  Bottom 0.254: v60.58,60.8 R18.P$2
PDI_DATA  (via drill 0.6)
  Top 0.254: U1.P56 38.1,32.29 38.1,31.84 35.56,29.3 35.56,28.54 37.08,27.02 46.74,27.02 48.51,28.8 48.51,33.62 v48.77,33.88
  Bottom 0.254: v48.77,33.88 49.28,33.88 49.78,34.38 50.04,34.38 55.12,39.46 55.12,45.81 55.88,46.58 61.72,46.58 62.23,47.08 62.23,51.91 PROG.1
PING_LED  (via drill 0.6)
  Top 0.254: U1.P7 35.05,43.36 v35.05,43.02
  Bottom 0.254: v35.05,43.02 36.07,42 44.96,42 48.77,45.81 51.31,45.81 55.12,49.62 55.12,56.99 56.39,58.26 R19.P$1
QA_0  (via drill 0.6)
  Top 0.254: R21.P$1 16.51,52.13 Q3.D 15.26,51.64 v15.24,51.66 | U1.P20 28.45,47.6 v28.45,46.83
  Bottom 0.254: 16,51.66 v15.24,51.66 17.02,49.88 24.38,49.88 27.43,46.83 v28.45,46.83
QA_0_EXT
  Top 0.254: R22.P$2 15.56,48.1 Q3.G 15.54,49.62 14.73,49.62 13.97,50.39 13.97,51.4 12.42,52.95 HEADER0.3
QA_1  (via drill 0.6)
  Top 0.254: Q5.D 16.51,21.65 R25.P$1 15.49,22.73 15.49,23.46 16,23.97 23.62,23.97 24.38,24.73 24.38,28.54 21.34,31.59 v21.34,32.86 | U1.P30 22.86,41.88 v22.86,41.24
  Bottom 0.254: v22.86,41.24 22.86,32.86 v21.34,32.86
QA_1_EXT  (1 unrouted)
  Top 0.254: R26.P$2 15.56,17.72 Q5.G 8.9,19.16 6.88,21.18
QB_0
  Top 0.254: R23.P$1 16.51,59.75 Q4.D 18.56,59.26 19.68,58.13 19.81,58.01 19.81,51.91 21.84,49.88 24.89,49.88 25.91,48.86 26.06,48.86 U1.P21
QB_0_EXT
  Top 0.254: Q4.G 15.56,55.82 R24.P$2 7.09,55.72 HEADER0.4
QB_1  (via drill 0.6)
  Top 0.254: Q6.D 16.51,29.27 R27.P$1 15.46,32.32 v15.49,32.35 | U1.P31 20.33,43.27 17.53,43.27 15.49,41.24 v15.49,36.16
  Bottom 0.254: v15.49,32.35 v15.49,36.16
QB_1_EXT  (1 unrouted)
  Top 0.254: Q6.G 15.56,25.34 R28.P$2 7.9,25.24 6.9,24.24
SCL  (via drill 0.6)
  Top 0.254: Q2.S 49.85,17.62 R15.P$1 49.75,19.69 45.72,23.72 34.29,23.72 v31.5,26.51 | v24.64,39.97 24.64,38.6 U1.P37
  Bottom 0.254: v31.5,26.51 31.5,33.37 24.89,39.97 v24.64,39.97
SDA  (via drill 0.6)
  Top 0.254: Q1.S 44.77,17.62 R13.P$1 44.67,21.21 42.93,22.95 33.53,22.95 v29.97,26.51 | v23.62,38.96 23.62,38.71 U1.P36
  Bottom 0.254: v29.97,26.51 30.99,27.53 30.99,33.11 25.15,38.96 v23.62,38.96
SEL0
  Top 0.254: U1.P46 27.18,30.95 27.18,29.05 28.45,27.78 32.26,27.78 35.56,24.48 46.23,24.48 50.55,20.16 57.66,20.16 58.17,19.65 58.17,15.59 60.2,13.56 62.74,13.56 63.5,14.32 SEL.6
SEL1
  Top 0.254: U1.P47 27.94,30.59 27.94,29.05 28.7,28.29 32.51,28.29 35.81,24.99 46.48,24.99 50.8,20.67 58.17,20.67 58.67,20.16 58.67,17.37 SEL.5
SEL2
  Top 0.254: U1.P48 28.45,29.96 28.45,29.56 29.21,28.8 32.77,28.8 36.07,25.49 46.74,25.49 51.05,21.18 58.42,21.18 59.18,20.41 59.18,19.4 SEL.3
SEL3
  Top 0.254: U1.P49 36.47,26 46.99,26 51.31,21.68 59.69,21.68 60.96,20.41 SEL.1
SEL4
  Top 0.254: U1.P50 33.27,30.33 33.27,30.07 36.84,26.51 47.24,26.51 51.56,22.19 62.23,22.19 63.5,20.92 SEL.2
SW0_0
  Top 0.254: U1.P40 23.82,34.38 9.4,34.38 7.37,36.42 7.37,43.27 5.33,45.31 5.33,57.42 HEADER0.5
SW0_1  (via drill 0.6)
  Top 0.254: U1.P42 26.92,35.23 v26.92,35.65
  Bottom 0.254: HEADER1.5 6.68,27.2 5.33,28.54 5.33,30.83 6.1,31.59 8.13,31.59 8.38,31.34 23.11,31.34 26.92,35.15 v26.92,35.65
SW1_0
  Top 0.254: U1.P41 24.44,33.88 9.14,33.88 6.86,36.16 6.86,43.02 4.83,45.05 4.83,59.92 HEADER0.6
SW1_1  (via drill 0.6)
  Top 0.254: U1.P43 27.47,34.64 v27.94,34.64
  Bottom 0.254: v27.94,34.64 23.5,30.2 HEADER1.6

### Text on the board
tPlace: 0 | 1 | 2 | 3 | 4 | 5 | 6 | 7
tNames: M0 | M1
bNames: Motor Control Logic V7 / Steven Brandt Apr 2017